# EasyEDA schematic SCH_usb_12v_ups_v0.1_2023-01-08.json
TITLE: Sheet_1; REV: 1.0; Date: 2022-10-30; Sheet: 1/1; Company: Your Company
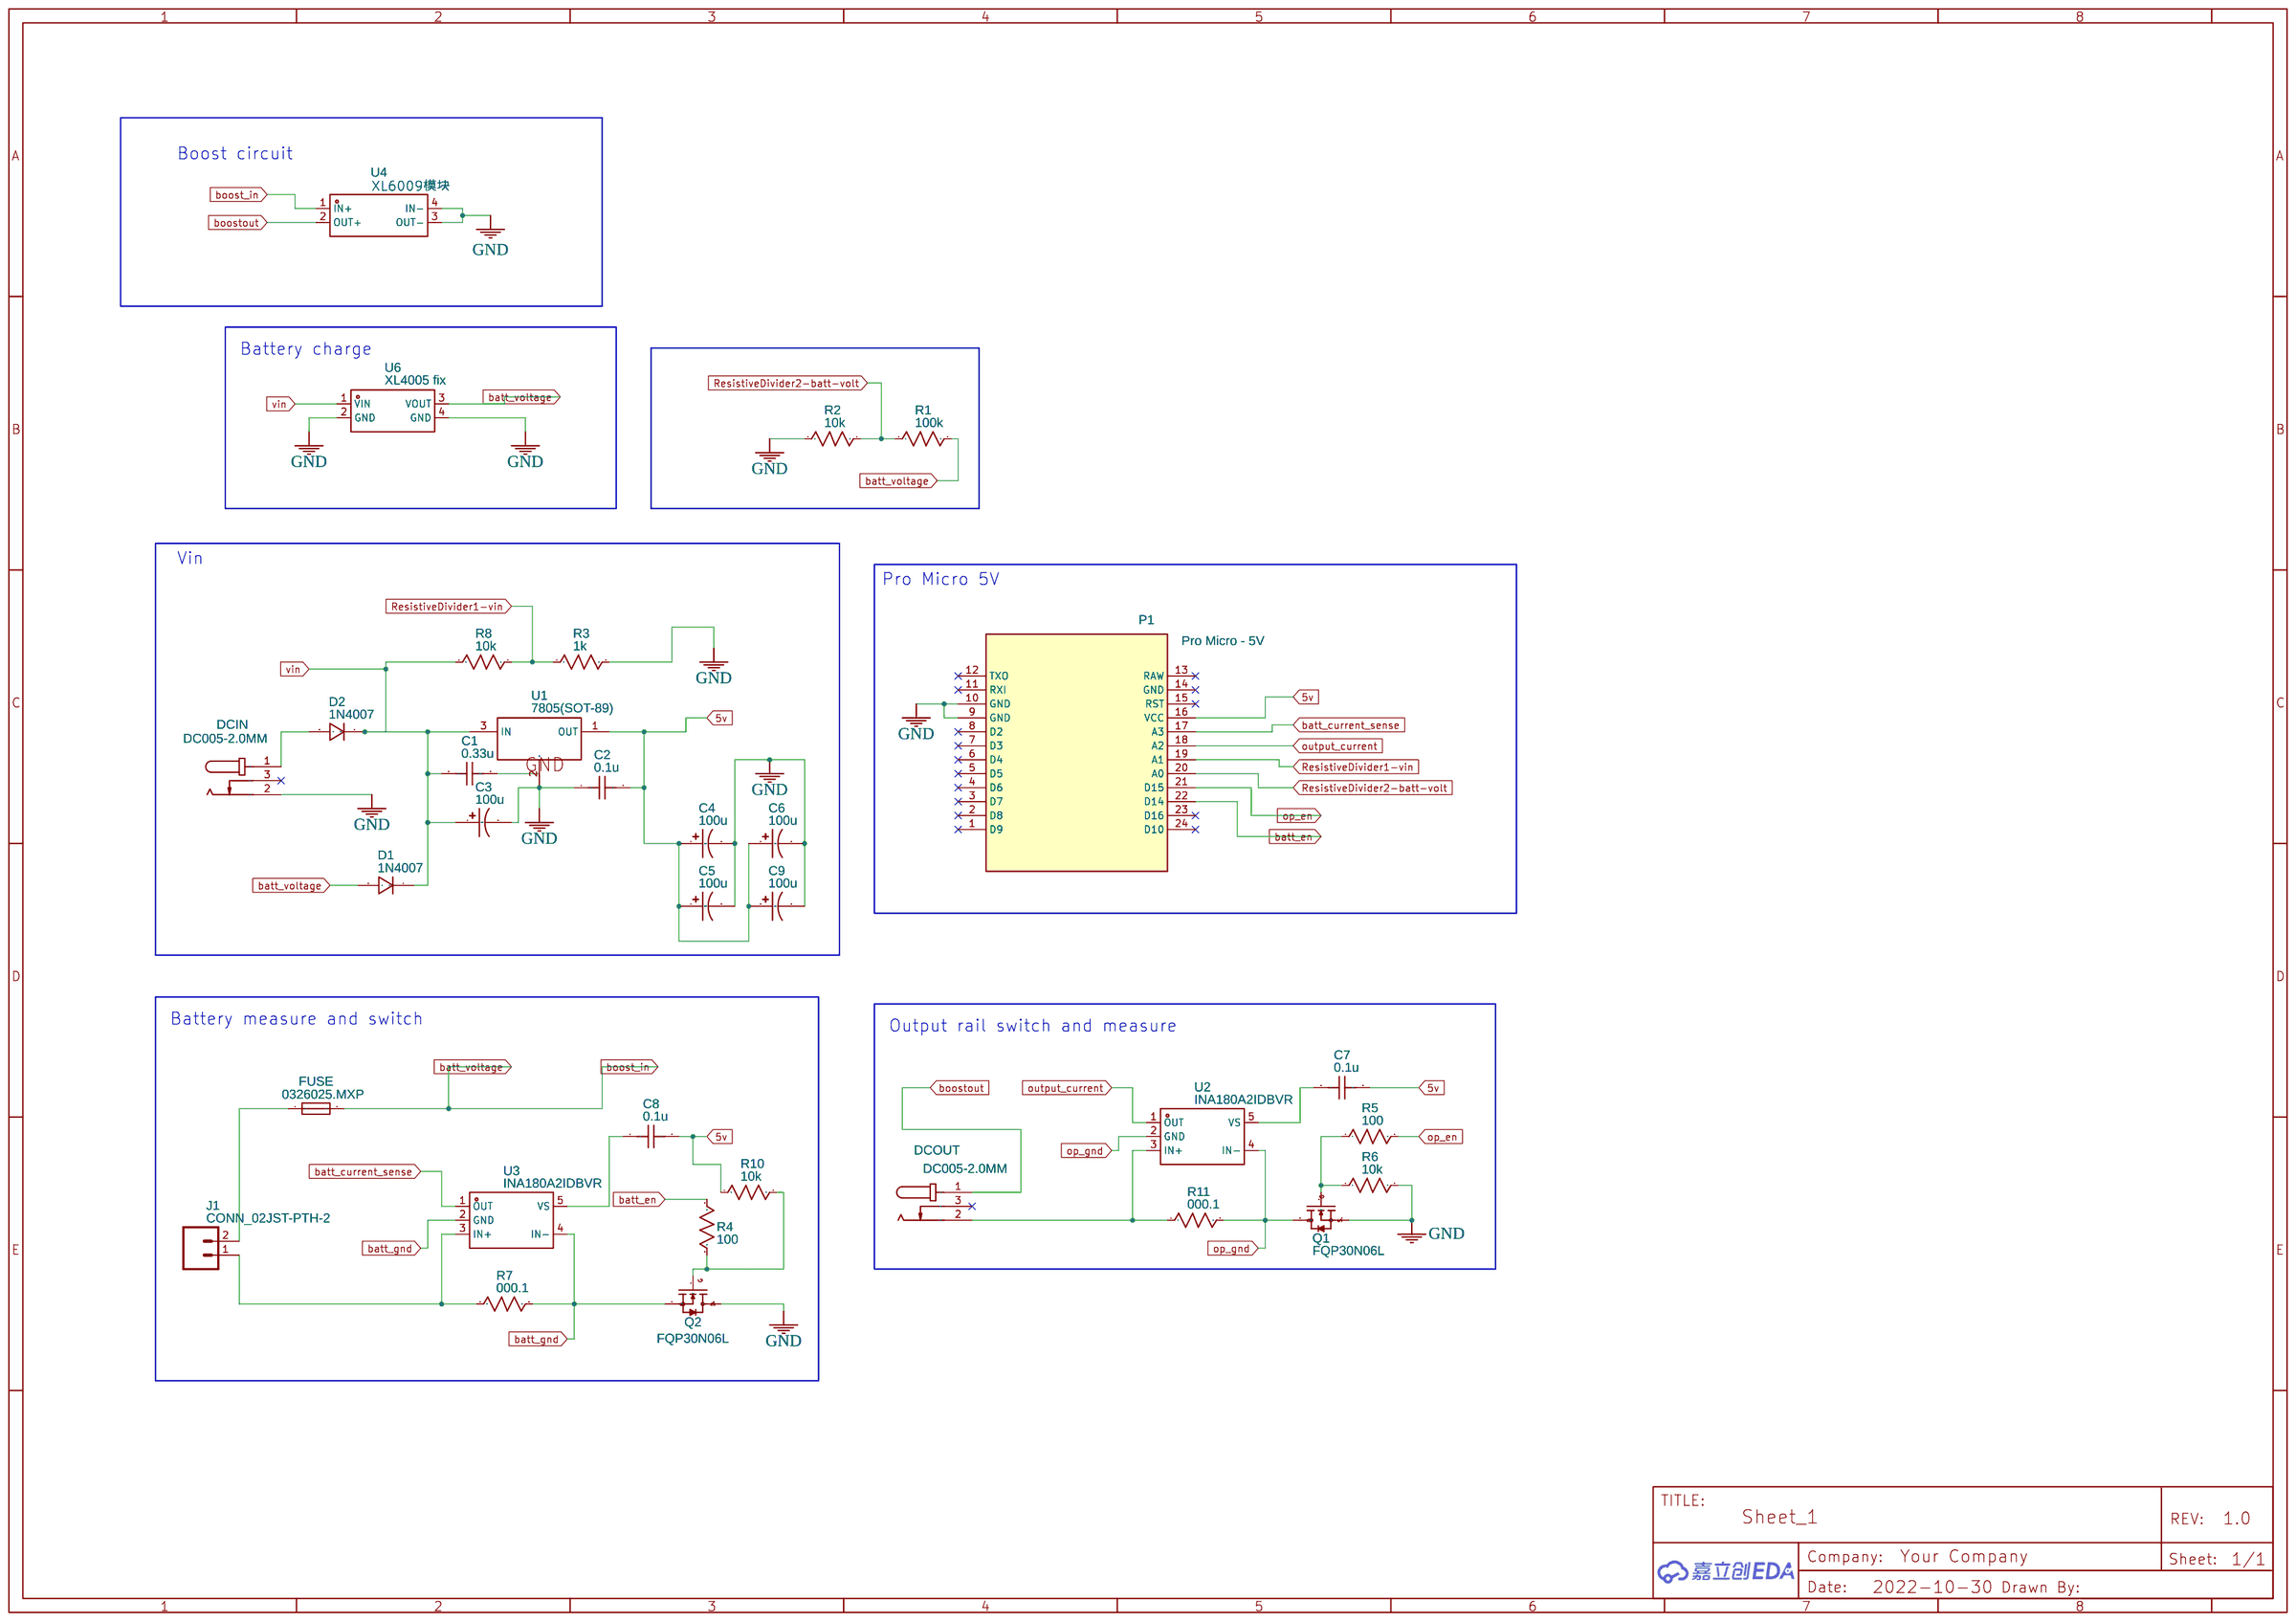
[diagram p0: schematic sheet]

## Parts
C1  0.33u  [C0603]
C2  0.1u  [C0603]
C3  100u  [CAP-D6.3×F2.5]
C4  100u  [CAP-D6.3×F2.5]
C5  100u  [CAP-D6.3×F2.5]
C6  100u  [CAP-D6.3×F2.5]
C7  0.1u  [RAD-0.1]
C8  0.1u  [RAD-0.1]
C9  100u  [CAP-D6.3×F2.5]
D1  1N4007  [DO-41_BD2.4-L4.7-P8.70-D0.9-RD]
D2  1N4007  [DO-41_BD2.4-L4.7-P8.70-D0.9-RD]
DCIN  DC005-2.0MM  [DC-IN-TH_DC005]
DCOUT  DC005-2.0MM  [DC-IN-TH_DC005]
FUSE  0326025.MXP  [FUSE-SMD_LITTELFUSE-0326025]
J1  CONN_02JST-PTH-2  [JST-2-PTH]
P1  Pro Micro - 5V  [PRO MICRO - 5V]
Q1  FQP30N06L  [TO220_CORRECT]
Q2  FQP30N06L  [TO220_CORRECT]
R1  100k  [R1210]
R2  10k  [R1210]
R3  1k  [R1210]
R4  100  [R1210]
R5  100  [R1210]
R6  10k  [R1210]
R7  000.1  [R_AXIAL-1.0]
R8  10k  [R1210]
R10  10k  [R1210]
R11  000.1  [R_AXIAL-1.0]
U1  7805(SOT-89)  [SOT-89-3_L4.5-W2.5-P1.50-LS4.2-BR]
U2  INA180A2IDBVR  [SOT-23-5_L3.0-W1.7-P0.95-LS2.8-BR]
U3  INA180A2IDBVR  [SOT-23-5_L3.0-W1.7-P0.95-LS2.8-BR]
U4  XL6009模块  [XFMR-SMD_XL6009]
U6  XL4005 fix  [XL4005 IC]

## Library data of the parts
C1 C2 = C_0603_US: Contributor: LCEDA_Lib
C3-C6 C9 = CE_TH_D6.3×F2.5_US: Contributor: LCEDA_Lib
C7 C8 = C_RAD-0.1_US: Contributor: LCEDA_Lib
D1 D2 = 1N4007: Supplier: LCSC; Manufacturer: SEMTECH; Supplier Part: C106903; Contributor: LCEDA_Lib
DCIN DCOUT = DC005-2.0MM: Supplier: LCSC; Manufacturer: SOFNG; Supplier Part: C111567
FUSE = 0326025.MXP: Supplier: LCSC; Supplier Part: C178977; Manufacturer: Littelfuse(美国力特); Contributor: arumugaraj
J1 = CONN_02JST-PTH-2: Contributor: Aisflou
P1 = Pro Micro - 5V: sourceId: 1T5FDZYC8
Q1 Q2 = FQP30N06L: sourceId: lTtPN9uQc
R1-R6 R8 R10 = R_1210_US: Contributor: LCEDA_Lib
R7 R11 = R_AXIAL-1.0_US: Contributor: LCEDA_Lib
U1 = 7805(SOT-89): Supplier: LCSC; Manufacturer: CJ; Manufacturer Part: CJ78L05; image: //image.lceda.cn/szlcsc/C2079.jpg; Supplier Part: C2079; Paste Type: expand; Contributor: LCEDA_Lib
U2 U3 = INA180A2IDBVR: Supplier: LCSC; Supplier Part: C192764; Manufacturer: TI(德州仪器); Contributor: LCSC; JLCPCB Part Class: Extended Part
U4 = XL6009模块: Supplier: LCSC; Supplier Part: C2908146; Manufacturer: null; Manufacturer Part: xl6009模块; JLCPCB Part Class: Extended Part; Contributor: LCSC
U6 = XL4005 fix: Contributor: 김동욱

## Nets
5v: C2.2 C4.1 C5.1 C6.1 C7.2 C8.2 C9.1 P1.16(VCC) R10.1 U1.1(OUT)
GND: C1.2 C2.1 C3.2 C4.2 C5.2 C6.2 C9.2 DCIN.2 P1.9(GND) P1.10(GND) Q1.3(S) Q2.2(D) R2.1 R3.2 R6.2 U1.2(GND) U4.3(OUT-) U4.4(IN-) U6.2(GND) U6.4(GND)
vin: C1.1 C3.1 D1.1 D2.1 R8.1 U1.3(IN) U6.1(VIN)
batt_current_sense: P1.17(A3) U3.1(OUT)
batt_en: P1.22(D14) R4.1
batt_gnd: Q2.3(S) R7.2 U3.2(GND) U3.4(IN-)
batt_voltage: D1.2 FUSE.2 R1.2 U4.1(IN+) U6.3(VOUT)
boostout: DCOUT.1 U4.2(OUT+)
op_en: P1.21(D15) R5.2
op_gnd: Q1.2(D) R11.2 U2.2(GND) U2.4(IN-)
output_current: P1.18(A2) U2.1(OUT)
ResistiveDivider1-vin: P1.19(A1) R3.1 R8.2
ResistiveDivider2-batt-volt: P1.20(A0) R1.1 R2.2
Net-(C7-1): C7.1 U2.5(VS)
Net-(C8-1): C8.1 U3.5(VS)
Net-(D2-2): D2.2 DCIN.1
Net-(DCOUT-2): DCOUT.2 R11.1 U2.3(IN+)
Net-(FUSE-1): FUSE.1 J1.2
Net-(J1-1): J1.1 R7.1 U3.3(IN+)
Net-(Q1-1): Q1.1(G) R5.1 R6.1
Net-(Q2-1): Q2.1(G) R4.2 R10.2

Not connected (* = marked no-connect by the designer): DCIN 3*; DCOUT 3*; P1 1(D9)* 2(D8)* 3(D7)* 4(D6)* 5(D5)* 6(D4)* 7(D3)* 8(D2)* 11(RXI)* 12(TXO)* 13(RAW)* 14(GND)* 15(RST)* 23(D16)* 24(D10)*

## Notes on the sheet
- Boost circuit
- Battery charge
- Vin
- Pro Micro 5V
- Battery measure and switch
- Output rail switch and measure
